# Altium schematic sheet main.SchDoc: TempeMaxMain
size A4; Date: 20232403; ApprovedBy: yo; CheckedBy: yo; Author: jmurilloh, jsarriac; CompanyName: UN; Organization: UN; DocumentNumber: 1; Revision: 0.1; SheetNumber: 1; SheetTotal: 4
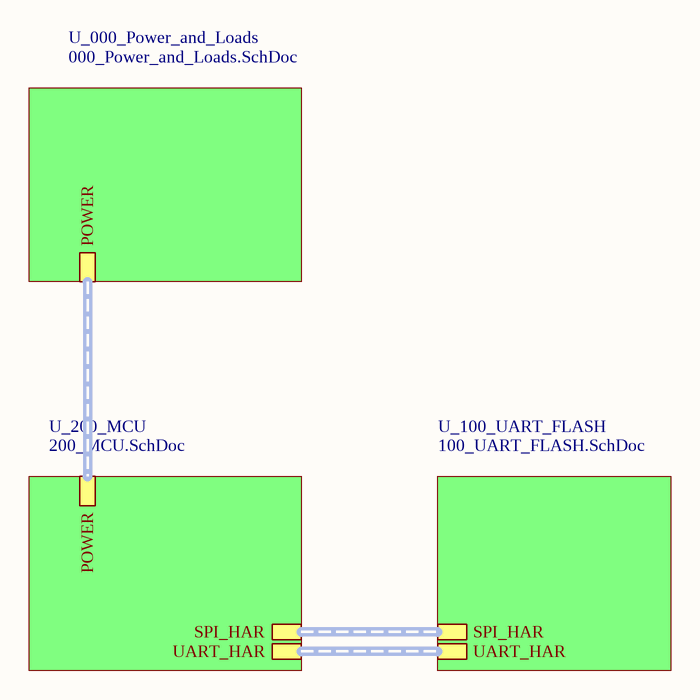
[diagram p0: main.SchDoc]

## Sub-sheets
U_000_Power_and_Loads = 000_Power_and_Loads.SchDoc: POWER (harness POWER_AND_LOADS)
U_100_UART_FLASH = 100_UART_FLASH.SchDoc: UART_HAR (harness UART_HAR), SPI_HAR (harness SPI_HAR)
U_200_MCU = 200_MCU.SchDoc: UART_HAR (harness UART_HAR), SPI_HAR (harness SPI_HAR), POWER (harness POWER_AND_LOADS)

## Buses and harness runs
harness sheet U_000_Power_and_Loads/POWER = sheet U_200_MCU/POWER
harness sheet U_100_UART_FLASH/SPI_HAR = sheet U_200_MCU/SPI_HAR
harness sheet U_100_UART_FLASH/UART_HAR = sheet U_200_MCU/UART_HAR

## Notes on the sheet
- Title
- Size:
- Date:
- A4
- Number:
- Time:
- Revision:
- Sheet
- of
- File: